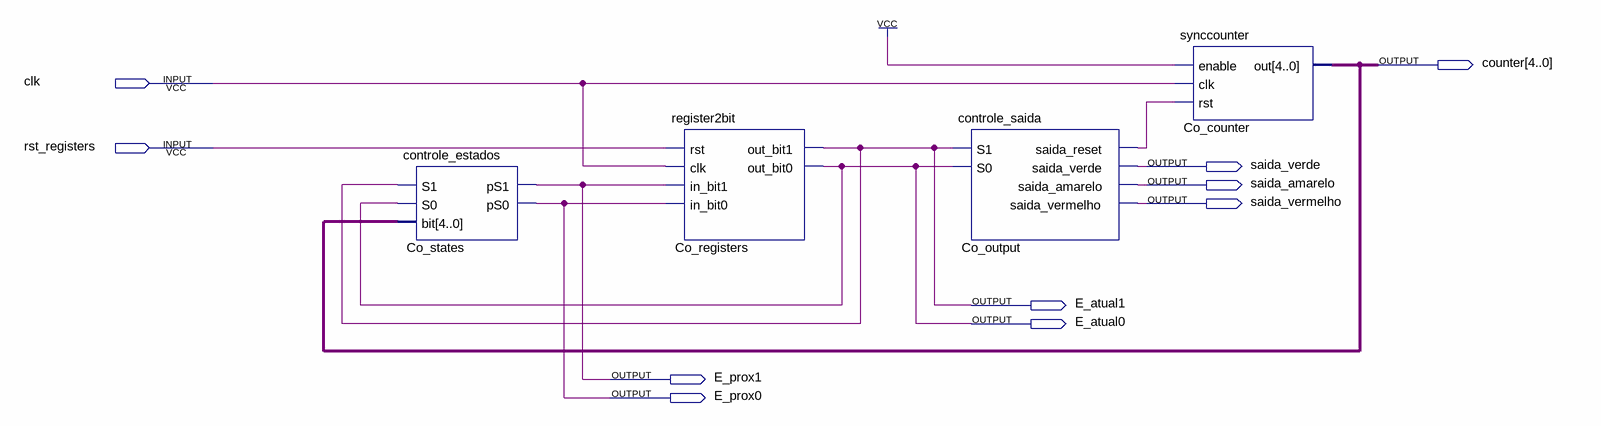
[diagram p0: schematic sheet]
// Quartus schematic test_fsm.bdf as structural Verilog: 4 symbols, 10 pins
module test_fsm (
  input  clk,
  input  rst_registers,
  output [4:0] counter,
  output saida_verde,
  output saida_amarelo,
  output saida_vermelho,
  output E_atual1,
  output E_atual0,
  output E_prox1,
  output E_prox0
);

  wire Co_output_saida_reset;

  controle_estados Co_states (.S1(E_atual1), .S0(E_atual0), .\bit (counter), .pS1(E_prox1), .pS0(E_prox0));
  register2bit Co_registers (
    .rst(rst_registers), .clk(clk), .in_bit1(E_prox1), .in_bit0(E_prox0), .out_bit1(E_atual1),
    .out_bit0(E_atual0));
  controle_saida Co_output (
    .S1(E_atual1), .S0(E_atual0), .saida_reset(Co_output_saida_reset), .saida_verde(saida_verde),
    .saida_amarelo(saida_amarelo), .saida_vermelho(saida_vermelho));
  synccounter Co_counter (.enable(1'b1), .clk(clk), .rst(Co_output_saida_reset), .out(counter));
endmodule
